# Altium schematic sheet power.SchDoc
size A4
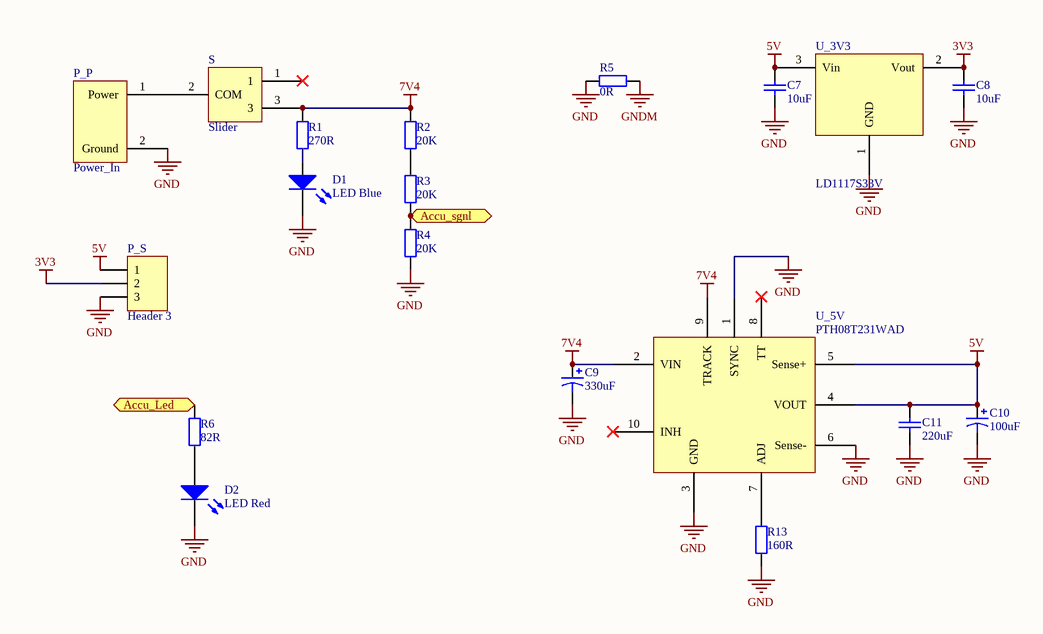
[diagram p0: power.SchDoc]

## Parts
C7  10uF  [FP_0805_CAP_085]
C8  10uF  [FP_0805_CAP_085]
C9  330uF  [FP_7343]
C10  100uF  [FP_3528]
C11  220uF  [FP_1206_CAP_125]
D1  LED Blue  [FP_0805_LED_RED]
D2  LED Red  [FP_0805_LED_RED]
P_P  Power_In  [SORK.3.81mm]
P_S  Header 3  [HDR1X3]
R1  270R  [FP_0805_RES]
R2  20K  [FP_0805_RES]
R3  20K  [FP_0805_RES]
R4  20K  [FP_0805_RES]
R5  0R  [FP_0805_RES]
R6  82R  [FP_0805_RES]
R13  160R  [FP_0805_RES]
S  Slider  [Slide]
U_3V3  LD1117S33V  [FP_SOT223]
U_5V  PTH08T231WAD  [5V SUPPLY]

## Ports
Accu_Led, Accu_sgnl

## Nets
3V3: C8.2 P_S.2 U_3V3.2(Vout)
5V: C7.2 C10.P C11.2 P_S.1 U_3V3.3(Vin) U_5V.4(VOUT) U_5V.5(Sense+)
7V4: C9.P R1.2 R2.2 S.3 U_5V.2(VIN) U_5V.9(TRACK)
GND: C7.1 C8.1 C9.N C10.N C11.1 D1.2(K) D2.2(K) P_P.2(Ground) P_S.3 R4.1 R5.1 R13.1 U_3V3.1(GND) U_5V.1(SYNC) U_5V.3(GND) U_5V.6(Sense-)
GNDM: R5.2
Accu_Led: R6.2 ; port Accu_Led
Accu_sgnl: R3.1 R4.2 ; port Accu_sgnl
NetD1_1: D1.1(A) R1.1
NetD2_1: D2.1(A) R6.1
NetP_P_1: P_P.1(Power) S.2(COM)
NetR2_1: R2.1 R3.2
NetR13_2: R13.2 U_5V.7(ADJ)

Not connected (* = marked no-connect by the designer): S 1*; U_5V 8(TT)* 10(INH)*

## Library data of the parts
C7 C8 = CAP 10uF: Capacitor; Tolerance: 10%; Voltage: 16V; Reference: 2320856; Name: SMD Multilayer Ceramic Capacitor, 0805; Supplier: Farnell; Value: 10uF
C9 = CAP_ELECT: Polarized Capacitor; Voltage: 10V; Tolerance: 20%; Reference: 2762172; Name: T491D337M010AT -  Surface Mount Tantalum Capacitor, 330 µF, 10 V, T491 Series, ± 20%, 2917 [7343 Metric]; Supplier: Farnell; Value: 330uF
C10 = CAP_ELECT: Polarized Capacitor; Voltage: 6.3V; Tolerance: 10%; Name: 100uF ˝B˝ 6.3V 10% TAJB107K006RNJ (AVX) 3528; Supplier: Lomex; Reference: 92-01-45; Value: 100uF
C11 = CAP: Capacitor; Tolerance: 20%; Voltage: 6.3V; Reference: 2671588; Name: GRM32ER60J227ME05L -  SMD Multilayer Ceramic Capacitor, 1210 [3225 Metric], 220 µF, 6.3 V, ± 20%, X5R, GRM Series; Supplier: Farnell; Value: 220uF
D1 = LED Blue: Blue LED; pin to pad: 1>A 2>K; U_fw: 3.3V; I_max: 25mA; Name: 2012 BLUE 465nm 170mcd FYLS-0805UBC (FYL) W.CLEAR 2.0x1.2x0.8mm 0805 130°; Wavelength: 465nm; Supplier: Lomex; Reference: 95-01-58
D2 = LED Red: Red LED; pin to pad: 1>A 2>K; U_fw: 1.9V; I_max: 30mA; Name: 2012 RED 643nm 28mcd FYLS-0805HRC (FYL) W.CLEAR 2.0x1.2x0.8mm 0805 130°; Wavelength: 643nm; Supplier: Lomex; Reference: 95-00-19
P_P = Power_In: Name: SORKAPOCS 2 P RM3.81 CSAPSORLÉC 90° TLPHC100R-02P (TLM) ZÁRT 10A 150V VDE; Supplier: Lomex; Reference: 43-27-99
P_S = Header 3: Header, 3-Pin; LatestRevisionDate: 17-Jul-2002; LatestRevisionNote: Re-released for DXP Platform.; Publisher: Altium Limited
R1 = RES 270R: Resistor; Tolerance: 5%; Power: 125mW; Name: YAGEO (PHYCOMP)  RC0805JR-07270RL  SMD Chip Resistor, Thick Film, 270 ohm; Reference: 9233938; Supplier: Farnell; Value: 270R
R2-R4 = RES: Resistor; Tolerance: 1%; Power: 0.125W; Name: 20K0 0805 1% CR-05FL7---20K 0.125W (VIK); Supplier: Lomex; Reference: 80-11-47; Value: 20K
R5 = RES: Resistor; Power: 0.125W; Name: 0R00 0805 CR-05JL7----0R 0.125W (VIK) Iav=2A; Supplier: Lomex; Reference: 81-10-02; Value: 0R
R6 = RES 82R: Resistor; Tolerance: 5%; Power: 125mW; Name: MULTICOMP  MCMR08X820 JTL  SMD Chip Resistor, Ceramic, 82 ohm; Reference: 2073848; Supplier: Farnell; Value: 82R
R13 = RES: Resistor; Tolerance: 1%; Power: 0.125W; Name: 160R 0805 1% RC0805FR-07160RL 0.125W (YAG); Supplier: Lomex; Reference: 80-01-97; Value: 160R
S = Slider: Name: Kapcsoló: csúszó; Pozíció:2; SPDT; 2A/250VAC; 5A/28VDC; ON-ON; Reference: 5MS1S102AM2QE; Supplier: TME
U_3V3 = LD1117S33V: Name: TS1117BCW-3.3 -  Fixed LDO Voltage Regulator, 0V to 12V, 1.3V Dropout, 3.3Vout, 800mAout, SOT-223-3; Reference: 7208359; Supplier: Farnell
U_5V = 5V_SUPPLY: Reference: 2383162; Name: PTH08T231WAD -  Non Isolated POL DC/DC Converter, 1 Output, 33 W, 5.5 V, 6 A, Adjustable, Through Hole; Supplier: Farnell